# Altium schematic sheet only_converter.SchDoc
size A4; SheetNumber: 2; SheetTotal: 2
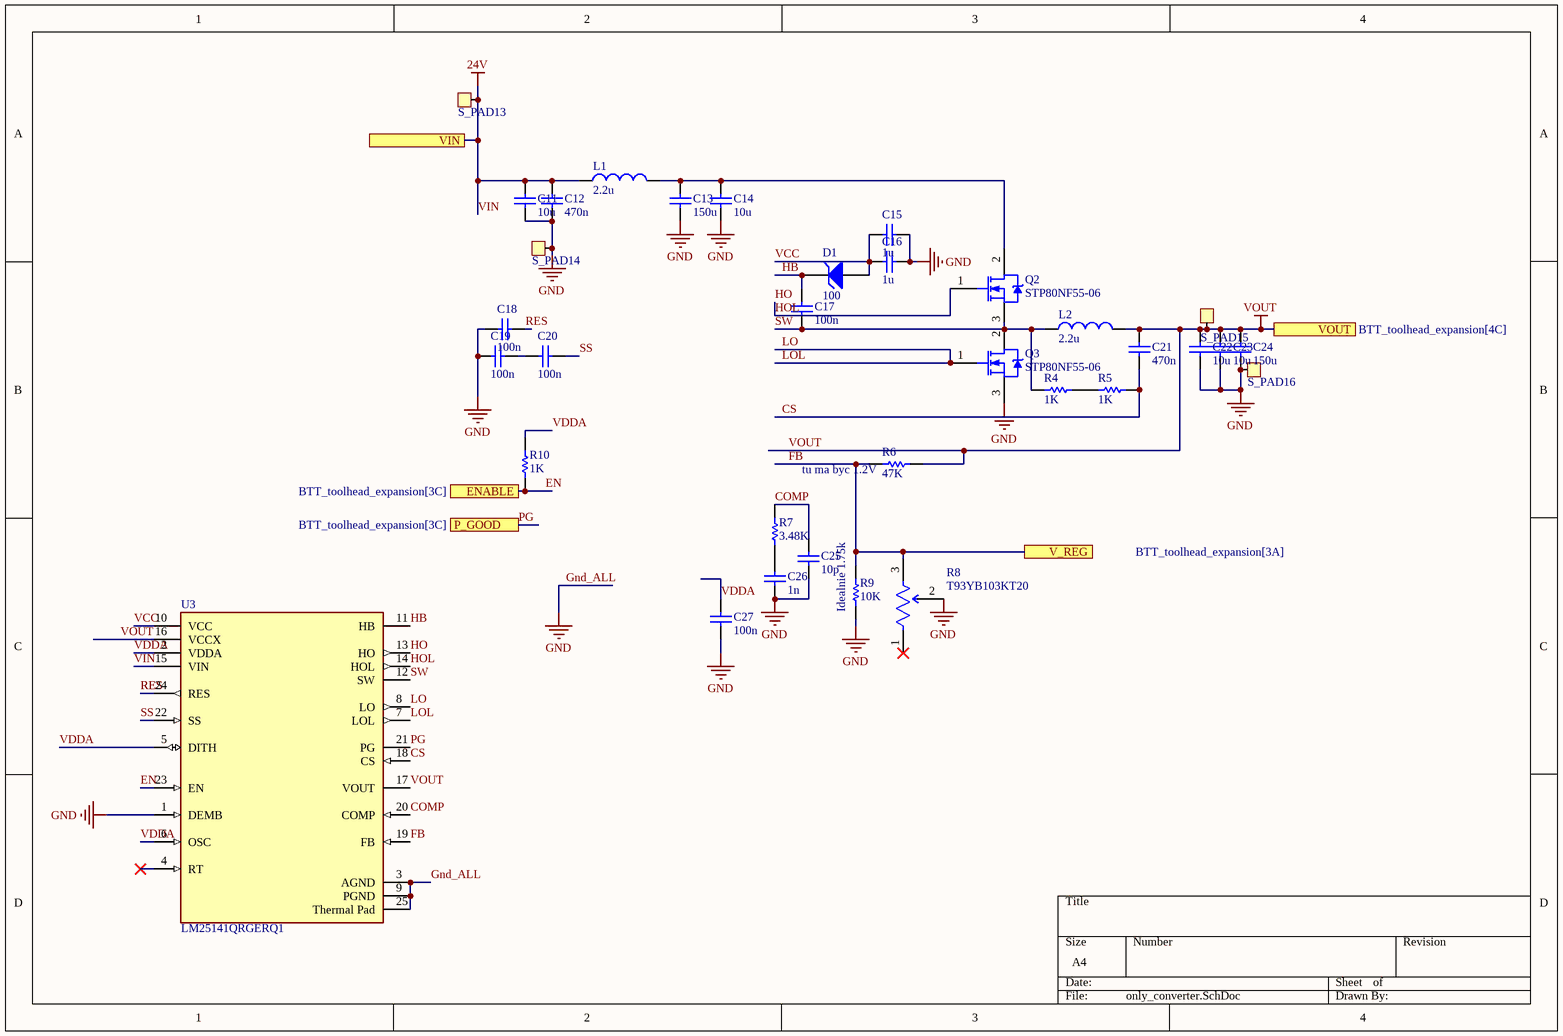
[diagram p0: only_converter.SchDoc]

## Parts
C11  value 10u  [CAP FILM 0805]  (hidden comment: Capacitor)
C12  value 470n  [CAP FILM 0603_1608]  (hidden comment: Capacitor)
C13  value 150u  [CAPAE7266X80M]  (hidden comment: Capacitor)
C14  value 10u  [CAP FILM 0805]  (hidden comment: Capacitor)
C15  value 1u  [CAP FILM 0603_1608]  (hidden comment: Capacitor)
C16  value 1u  [CAP FILM 0603_1608]  (hidden comment: Capacitor)
C17  value 100n  [CAP FILM 0603_1608]  (hidden comment: Capacitor)
C18  value 100n  [CAP FILM 0603_1608]  (hidden comment: Capacitor)
C19  value 100n  [CAP FILM 0603_1608]  (hidden comment: Capacitor)
C20  value 100n  [CAP FILM 0603_1608]  (hidden comment: Capacitor)
C21  value 470n  [CAP FILM 0603_1608]  (hidden comment: Capacitor)
C22  value 10u  [CAP FILM 0603_1608]  (hidden comment: Capacitor)
C23  value 10u  [CAP FILM 0603_1608]  (hidden comment: Capacitor)
C24  value 150u  [CAPAE7266X80M]  (hidden comment: Capacitor)
C25  value 10p  [CAP FILM 0603_1608]  (hidden comment: Capacitor)
C26  value 1n  [CAP FILM 0603_1608]  (hidden comment: Capacitor)
C27  value 100n  [CAP FILM 0603_1608]  (hidden comment: Capacitor)
D1  BV: 100  [SODFL375X135-2N]  (hidden comment: Zener Diode)
L1  value 2.2u  [INDP135128X65N]  (hidden comment: Inductor)
L2  value 2.2u  [INDP135128X65N]  (hidden comment: Inductor)
Q2  STP80NF55-06  [STM-TO-220A-3]
Q3  STP80NF55-06  [STM-TO-220A-3]
R4  value 1K  [RES 0603_1608]  (hidden comment: Resistor)
R5  value 1K  [RES 0603_1608]  (hidden comment: Resistor)
R6  value 47K  [RES 0603_1608]  (hidden comment: Resistor)
R7  value 3.48K  [RES 0603_1608]  (hidden comment: Resistor)
R8  T93YB103KT20  [FP-T93YB-MFG]
R9  value 10K  [RES 0603_1608]  (hidden comment: Resistor)
R10  value 1K  [RES 0603_1608 RF]  (hidden comment: Resistor)
S_PAD13  SOLDER_PAD  [POWER_PAD]  (value not drawn)
S_PAD14  SOLDER_PAD  [POWER_PAD]  (value not drawn)
S_PAD15  SOLDER_PAD  [POWER_PAD]  (value not drawn)
S_PAD16  SOLDER_PAD  [POWER_PAD]  (value not drawn)
U3  LM25141QRGERQ1  [FP-RGE0024J-IPC_A]

## Ports
ENABLE (see BTT_toolhead_expansion[3C]), P_GOOD (see BTT_toolhead_expansion[3C]), V_REG (see BTT_toolhead_expansion[3A]), VIN, VOUT (see BTT_toolhead_expansion[4C])

## Nets
Gnd_ALL: C11.1 C12.1 C13.1 C14.1 C15.1 C16.1 C18.1 C19.1 C22.1 C23.1 C24.1 C25.1 C26.1 C27.1 Q3.3(S) R8.2(b) R9.1 S_PAD14.1 S_PAD16.1 U3.1(DEMB) U3.3(AGND) U3.9(PGND) U3.25(Thermal_Pad)  [also labelled GND]
VIN: C11.2 C12.2 L1.1 S_PAD13.1 U3.15(VIN) ; port VIN  [also labelled 24V]
VOUT: C21.2 C22.2 C23.2 C24.2 L2.2 R6.2 S_PAD15.1 U3.16(VCCX) U3.17(VOUT) ; port VOUT
COMP: C25.2 R7.2 U3.20(COMP)
CS: C21.1 R5.2 U3.18(CS)
EN: R10.1 U3.23(EN) ; port ENABLE
FB: R6.1 R8.3(c) R9.2 U3.19(FB) ; port V_REG
HB: C17.2 D1.2(K) U3.11(HB)
HO: Q2.1(G) U3.13(HO) U3.14(HOL)  [also labelled HOL]
LO: Q3.1(G) U3.7(LOL) U3.8(LO)  [also labelled LOL]
PG: U3.21(PG) ; port P_GOOD
RES: C18.2 U3.24(RES)
SS: C20.2 U3.22(SS)
SW: C17.1 L2.1 Q2.3(S) Q3.2(D) R4.1 U3.12(SW)
VCC: C15.2 C16.2 D1.1(A) U3.10(VCC)
VDDA: C27.2 R10.2 U3.2(VDDA) U3.5(DITH) U3.6(OSC)
NetC13_2: C13.2 C14.2 L1.2 Q2.2(D)
NetC19_2: C19.2 C20.1
NetC26_2: C26.2 R7.1
NetR4_2: R4.2 R5.1

Not connected (* = marked no-connect by the designer): R8 1(a)*; U3 4(RT)*

## Notes on the sheet
- (near R6) tu ma byc 1.2V
- (near R9) Idealnie 1.75k

## Library data of the parts
C11 C14 C22 C23 = Capacitor: Daj tu ten wiekszy 0805 dzbanie; SimulationGenericComponent: True
C12 C15-C21 C25-C27 = Capacitor: SimulationGenericComponent: True
C13 C24 = Capacitor: to ten duzy elektrolityczny smd; SimulationGenericComponent: True
D1 = Zener Diode: AF: 1; BV_MAX: 1e99; CJO: 0; EG: 1.11; FC: 0.5; IBV: 0.001; IS: 1e-14; MJSW: 0.33; NTUN: 30; TNOM: 27; XTI: 3; SimulationGenericComponent: True; CJP: 0; CTA: 0; CTP: 0; FCS: 0.5; FV_MAX: 1e99; IKF: 0; IKR: 0; ISR: 1e-14; JSW: 0; JTUN: 0; JTUNSW: 0; KEG: 1; KF: 0; LEVEL: 1; N: 1; NBV: 1; NR: 1; NS: 1; PHP: 1; RS: 0; TCV: 0; TLEV: 0; TLEVC: 0; TM1: 0; TM2: 0; TPB: 0; TPHP: 0; TRS: 0; TRS2: 0; TT: 0; TTT1: 0; TTT2: 0; VJ: 1; XTITUN: 3
L1 L2 = Inductor: SimulationGenericComponent: True
Q2 Q3 = CMP-2000-07168-1: N-Channel STripFET(TM) II Power MOSFET, 55 V, 80 A, 5 mOhm, -55 to 175 degC, 3-Pin TO-220, RoHS, Tube; Manufacturer: STMicroelectronics; Minimum Gate Threshold Voltage: 2V; Maximum Gate Threshold Voltage: 4V; Channel Type: N; Maximum Drain Source Voltage: 55V; Transistor Configuration: Single; Maximum Drain Source Resistance: 0.007Ω; Number of Elements per Chip: 1; Maximum Continuous Drain Current: 80A; Typical Gate Charge @ Vgs: 142nC@10V; Channel Mode: Enhancement; Typical Turn-Off Delay Time: 125ns; Maximum Gate Source Voltage: ±20V; Transistor Material: Si; Maximum Power Dissipation: 300W; Typical Input Capacitance @ Vds: 4400pF@25V; Typical Turn-On Delay Time: 27ns; Length: 10.4mm; Datasheet Version: Rev. 8, 10/2006; Package Type: TO-220; Minimum Operating Temperature: -55°C; Pin Count: 3; Package Description: 3-Pin Transistor Outline Package, 10.2 x 4.5 mm, Pitch 2.55 mm; Mounting Type: ThroughHole; Datasheet URL: http://www.st.com/content/ccc/resource/technical/document/datasheet/f1/46/49/9e/39/8f/49/aa/CD00002670.pdf/files/CD00002670.pdf/jcr:content/translations/en.CD00002670.pdf; Manufacturer URL: http://www.st.com/; Package URL: http://www.st.com/st-web-ui/static/active/en/resource/technical/document/datasheet/CD00000544.pdf; Height: 9.15mm; Width: 4.6mm; Dimensions: 10.4x4.6x9.15mm; Maximum Operating Temperature: +175°C; Category: PowerMOSFET; Package Reference: TO-220; Mounting Technology: ThroughHole
R4-R7 R9 R10 = Resistor: TC1: 0; SimulationGenericComponent: True; TC2: 0
R8 = CMP-00030-39738570-1: T93YB103KT20 Resistor Trimmer, Cermet, 10 kOhm, ± 10%, 500 mW, 23 Turn, Multi Turn, Through Hole; Power Rating: 500mW; Number of Turns: 21; Voltage Rating (DC): 250V; Resistance: 10kΩ; Temperature Coefficient: 100ppm/°C; Radiation Hardening: No; NexarPartId: 39738570; Max Power Dissipation: 500mW; Military Standard: Not; Max Operating Temperature: 125°C; REACH SVHC: Unknown; Height: 9.8044mm; Voltage Rating: 250V; RoHS: Compliant; Min Operating Temperature: -55°C; Mount: PCB, Through Hole; Width: 5.0038mm; Taper: Linear; Termination: Pin; Composition: Cermet; Lead Free: Lead Free; Weight: 820.009956mg; Depth: 5mm; Schedule B: 8533400080, 8533400080; Tolerance: 10%; Length: 9.7028mm
U3 = CMP-04918-000466-1: AUTOMOTIVE, 2.2MHZ, LOW IQ SYNCH; Max Operating Temperature: 125°C; Min Operating Temperature: -40°C